# Altium schematic sheet Cover Sheet.SchDoc: Cover Page
size B; Organization: ToyBuilder Labs; Address1: 2736 E Walnut St; Address2: Pasadena, California 91107; Address4: +1 (626) 808-4010; DocumentNumber: 1; SheetNumber: 1; SheetTotal: 2
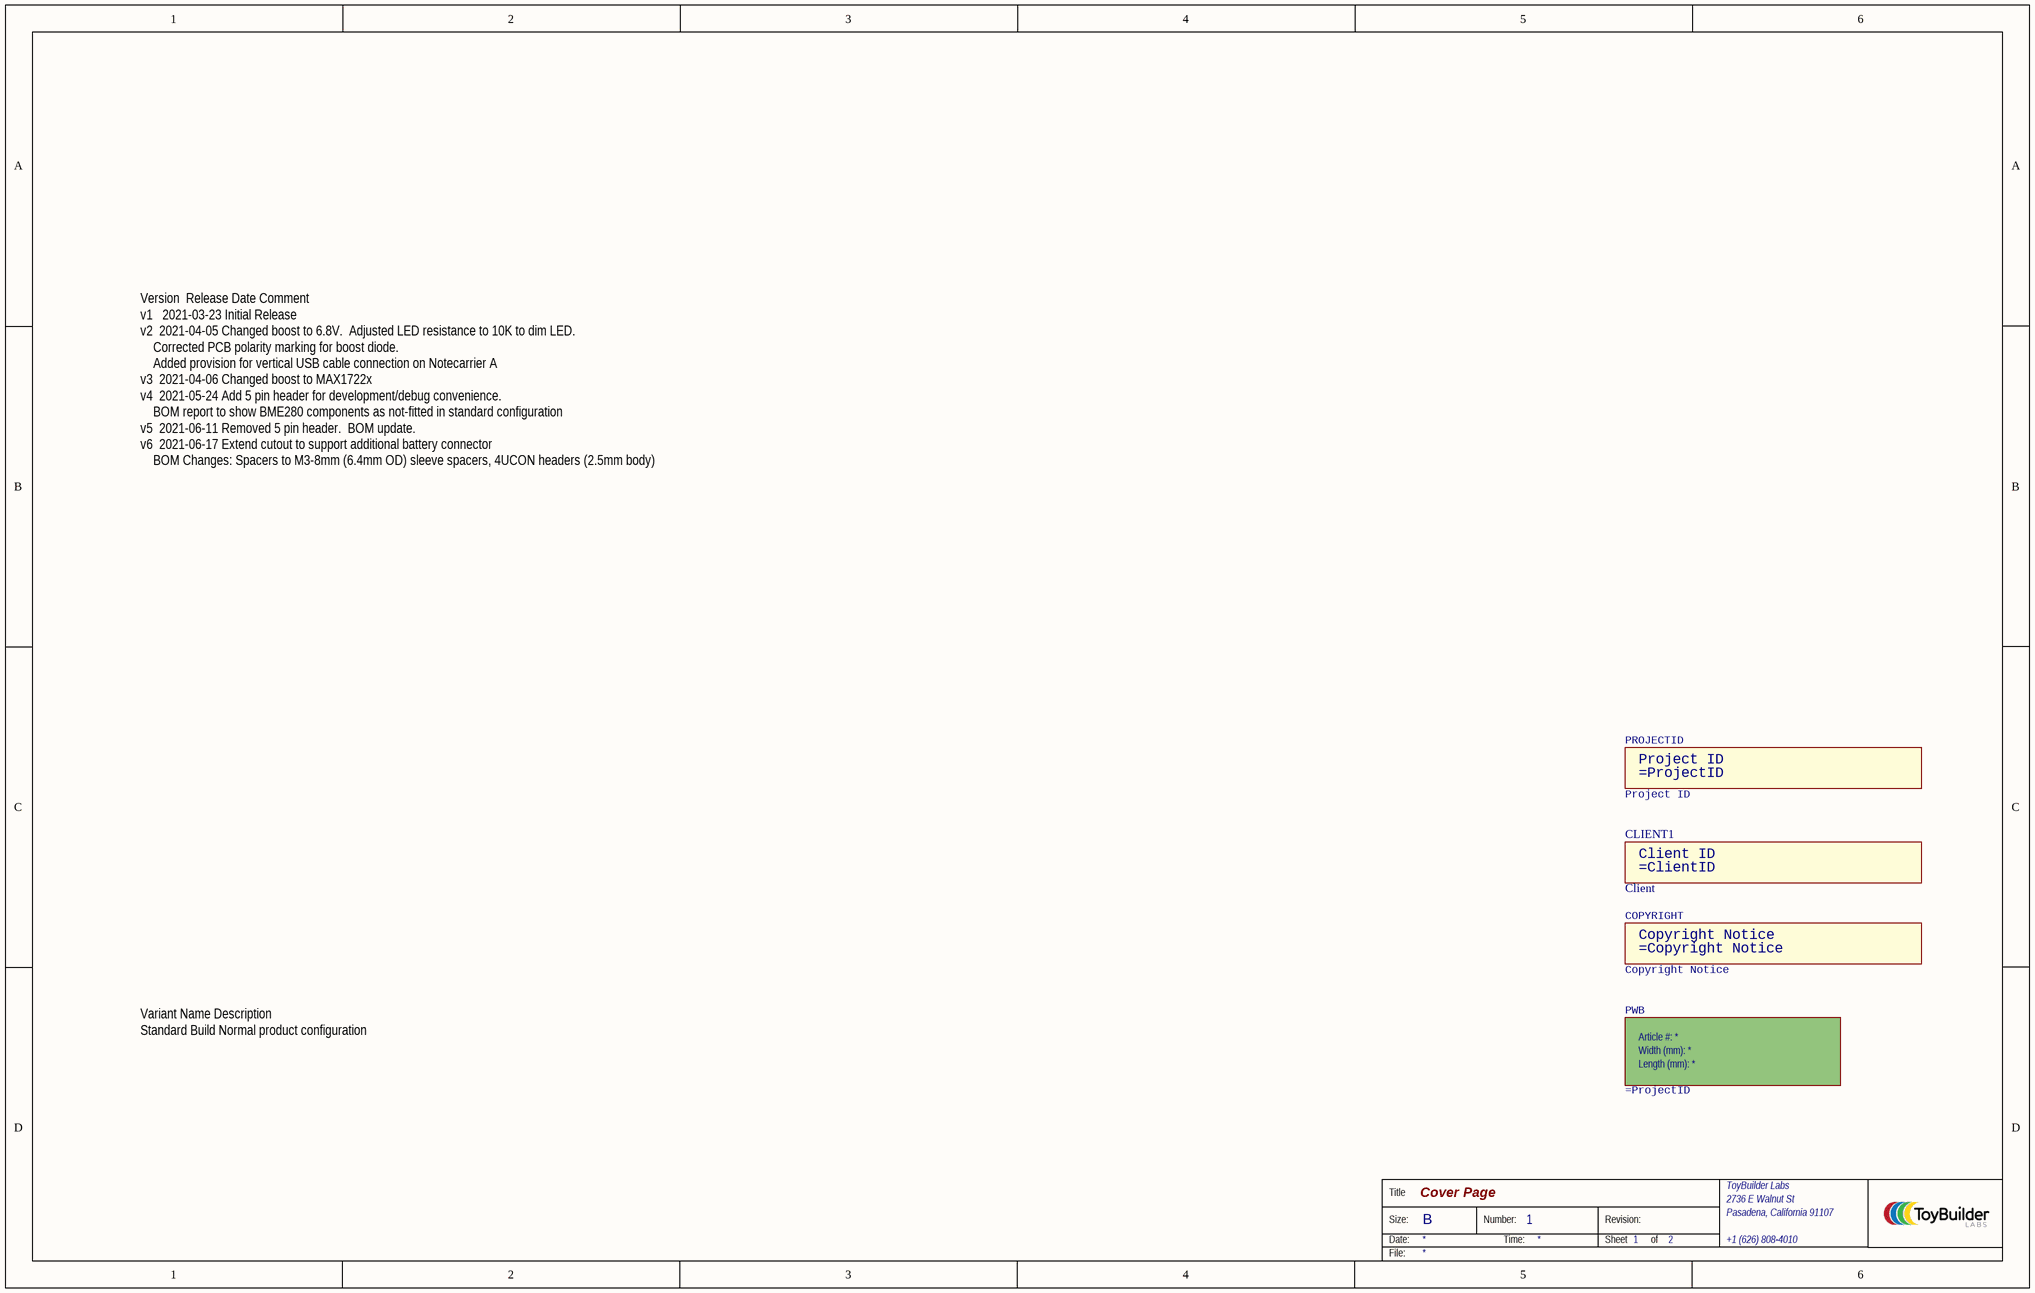
[diagram p0: Cover Sheet.SchDoc]

## Parts
CLIENT1  Client  [CLIENT_MARK]  (no BOM)
COPYRIGHT  Copyright Notice  [COPYRIGHT_MARK]  (no BOM)
PROJECTID  Project ID  [PROJECTID_MARK]  (no BOM)
PWB  (no value)  (mechanical)

## Notes on the sheet
- Version		Release Date	Comment
  v1 		2021-03-23	Initial Release
  v2		2021-04-05	Changed boost to 6.8V.  Adjusted LED resistance to 10K to dim LED.
  Corrected PCB polarity marking for boost diode.
  Added provision for vertical USB cable connection on Notecarrier A
  v3		2021-04-06	Changed boost to MAX1722x
  v4		2021-05-24	Add 5 pin header for development/debug convenience.
  BOM report to show BME280 components as not-fitted in standard configuration
  v5		2021-06-11	Removed 5 pin header.  BOM update.
  v6		2021-06-17	Extend cutout to support additional battery connector
  BOM Changes: Spacers to M3-8mm (6.4mm OD) sleeve spacers, 4UCON headers (2.5mm body)
- Variant Name	Description
  Standard Build	Normal product configuration
- Title
- Size:
- Date:
- B
- Number:
- Time:
- Revision:
- Sheet
- of
- File:

## Library data of the parts
CLIENT1 = CLIENTID_MARK: Client ID
COPYRIGHT = COPYRIGHT_MARK
PROJECTID = PROJECTID_MARK
PWB = BOM_PWB_ID: Printed Circuit Board; Length (mm): *; Width (mm): *; Article #: *